# Altium project 8MPLUSLPD4-CPU.PrjPcb (part 3 of 3)

## Sheet Page12 SOM Interface.SchDoc
size 513 x 386 mm
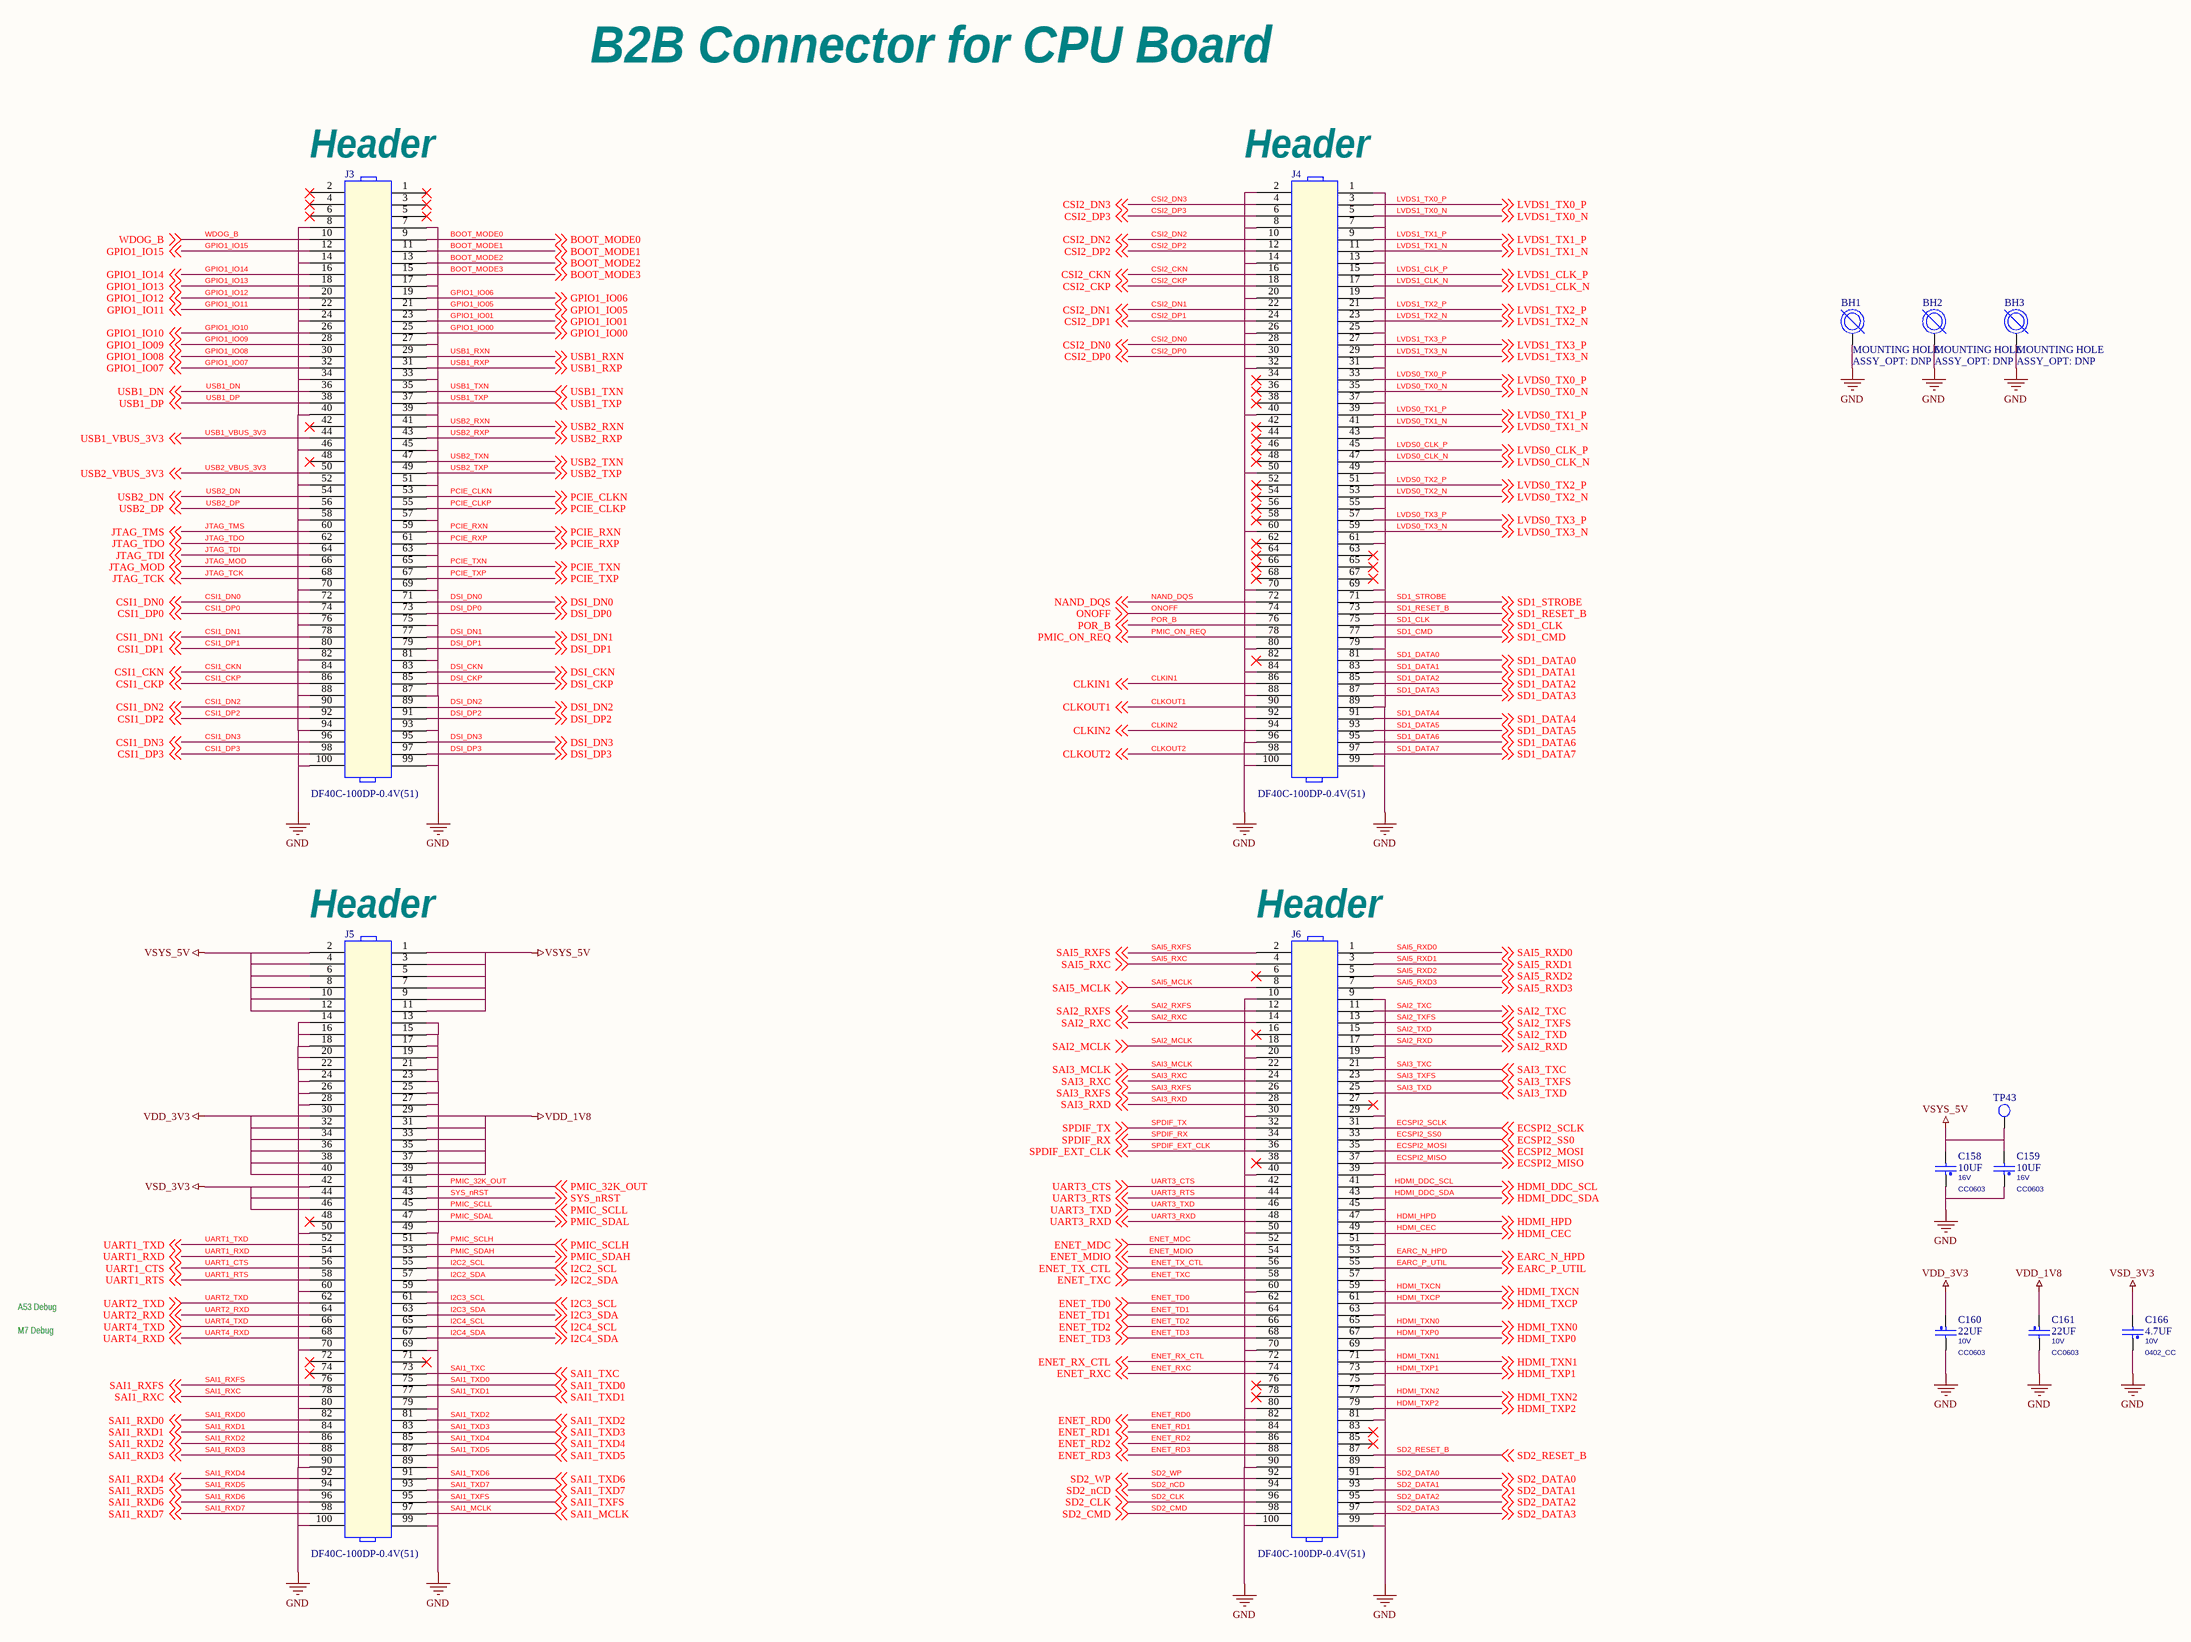
[diagram p17: Page12 SOM Interface.SchDoc]

### Parts
BH1  MOUNTING HOLE  ASSY_OPT: DNP  [GNDPOINT256]
BH2  MOUNTING HOLE  ASSY_OPT: DNP  [GNDPOINT256]
BH3  MOUNTING HOLE  ASSY_OPT: DNP  [GNDPOINT256]
C158  10UF  VOLTAGE: 16V  [CC0603]
C159  10UF  VOLTAGE: 16V  [CC0603]
C160  22UF  VOLTAGE: 10V  [CC0603]
C161  22UF  VOLTAGE: 10V  [CC0603]
C166  4.7UF  VOLTAGE: 10V  [0402_CC]
J3  DF40C-100DP-0.4V(51)  [con100_0p4_21p7x2p05_sm]
J4  DF40C-100DP-0.4V(51)  [con100_0p4_21p7x2p05_sm]
J5  DF40C-100DP-0.4V(51)  [con100_0p4_21p7x2p05_sm]
J6  DF40C-100DP-0.4V(51)  [con100_0p4_21p7x2p05_sm]
TP43  TP_35MIL  [testpoint_35mil]  (value not drawn)

### Nets
GND: BH1.1 BH2.1 BH3.1 C158.1 C159.1 C160.2 C161.2 C166.1 J3.7 J3.8 J3.14 J3.17 J3.24 J3.27 J3.33 J3.34 J3.39 J3.40 J3.45 J3.46 J3.51 J3.52 J3.57 J3.58 J3.63 J3.69 J3.70 J3.75 J3.76 J3.81 J3.82 J3.87 J3.88 J3.93 J3.94 J3.99 J3.100 J4.1 J4.2 J4.7 J4.8 J4.13 J4.14 J4.19 J4.20 J4.25 J4.26 J4.31 J4.32 J4.37 J4.40 J4.43 J4.49 J4.50 J4.55 J4.60 J4.61 J4.69 J4.70 J4.79 J4.80 J4.84 J4.88 J4.89 J4.92 J4.96 J4.99 J4.100 J5.13 J5.14 J5.15 J5.16 J5.17 J5.18 J5.19 J5.20 J5.21 J5.22 J5.23 J5.24 J5.25 J5.26 J5.27 J5.28 J5.49 J5.50 J5.59 J5.60 J5.69 J5.70 J5.79 J5.80 J5.89 J5.90 J5.99 J5.100 J6.9 J6.10 J6.19 J6.20 J6.29 J6.30 J6.39 J6.40 J6.45 J6.50 J6.51 J6.57 J6.60 J6.63 J6.69 J6.70 J6.75 J6.80 J6.81 J6.89 J6.90 J6.99 J6.100
VDD_1V8: C161.1 J5.29 J5.31 J5.33 J5.35 J5.37 J5.39
VDD_3V3: C160.1 J5.30 J5.32 J5.34 J5.36 J5.38 J5.40
VSD_3V3: C166.2 J5.42 J5.44 J5.46
VSYS_5V: C158.2 C159.2 J5.1 J5.2 J5.3 J5.4 J5.5 J5.6 J5.7 J5.8 J5.9 J5.10 J5.11 J5.12 TP43.1(TP)
BOOT_MODE0: J3.9 ; off-sheet BOOT_MODE0
BOOT_MODE1: J3.11 ; off-sheet BOOT_MODE1
BOOT_MODE2: J3.13 ; off-sheet BOOT_MODE2
BOOT_MODE3: J3.15 ; off-sheet BOOT_MODE3
CLKIN1: J4.86 ; off-sheet CLKIN1
CLKIN2: J4.94 ; off-sheet CLKIN2
CLKOUT1: J4.90 ; off-sheet CLKOUT1
CLKOUT2: J4.98 ; off-sheet CLKOUT2
CSI1_CKN: J3.84 ; off-sheet CSI1_CKN  [project net CSI1_CK_N]
CSI1_CKP: J3.86 ; off-sheet CSI1_CKP  [project net CSI1_CK_P]
CSI1_DN0: J3.72 ; off-sheet CSI1_DN0  [project net CSI1_D0_N]
CSI1_DN1: J3.78 ; off-sheet CSI1_DN1  [project net CSI1_D1_N]
CSI1_DN2: J3.90 ; off-sheet CSI1_DN2  [project net CSI1_D2_N]
CSI1_DN3: J3.96 ; off-sheet CSI1_DN3  [project net CSI1_D3_N]
CSI1_DP0: J3.74 ; off-sheet CSI1_DP0  [project net CSI1_D0_P]
CSI1_DP1: J3.80 ; off-sheet CSI1_DP1  [project net CSI1_D1_P]
CSI1_DP2: J3.92 ; off-sheet CSI1_DP2  [project net CSI1_D2_P]
CSI1_DP3: J3.98 ; off-sheet CSI1_DP3  [project net CSI1_D3_P]
CSI2_CKN: J4.16 ; off-sheet CSI2_CKN  [project net CSI2_CK_N]
CSI2_CKP: J4.18 ; off-sheet CSI2_CKP  [project net CSI2_CK_P]
CSI2_DN0: J4.28 ; off-sheet CSI2_DN0  [project net CSI2_D0_N]
CSI2_DN1: J4.22 ; off-sheet CSI2_DN1  [project net CSI2_D1_N]
CSI2_DN2: J4.10 ; off-sheet CSI2_DN2  [project net CSI2_D2_N]
CSI2_DN3: J4.4 ; off-sheet CSI2_DN3  [project net CSI2_D3_N]
CSI2_DP0: J4.30 ; off-sheet CSI2_DP0  [project net CSI2_D0_P]
CSI2_DP1: J4.24 ; off-sheet CSI2_DP1  [project net CSI2_D1_P]
CSI2_DP2: J4.12 ; off-sheet CSI2_DP2  [project net CSI2_D2_P]
CSI2_DP3: J4.6 ; off-sheet CSI2_DP3  [project net CSI2_D3_P]
DSI_CKN: J3.83 ; off-sheet DSI_CKN  [project net DSI_CK_N]
DSI_CKP: J3.85 ; off-sheet DSI_CKP  [project net DSI_CK_P]
DSI_DN0: J3.71 ; off-sheet DSI_DN0  [project net DSI_D0_N]
DSI_DN1: J3.77 ; off-sheet DSI_DN1  [project net DSI_D1_N]
DSI_DN2: J3.89 ; off-sheet DSI_DN2  [project net DSI_D2_N]
DSI_DN3: J3.95 ; off-sheet DSI_DN3  [project net DSI_D3_N]
DSI_DP0: J3.73 ; off-sheet DSI_DP0  [project net DSI_D0_P]
DSI_DP1: J3.79 ; off-sheet DSI_DP1  [project net DSI_D1_P]
DSI_DP2: J3.91 ; off-sheet DSI_DP2  [project net DSI_D2_P]
DSI_DP3: J3.97 ; off-sheet DSI_DP3  [project net DSI_D3_P]
EARC_N_HPD: J6.53 ; off-sheet EARC_N_HPD
EARC_P_UTIL: J6.55 ; off-sheet EARC_P_UTIL
ECSPI2_MISO: J6.37 ; off-sheet ECSPI2_MISO
ECSPI2_MOSI: J6.35 ; off-sheet ECSPI2_MOSI
ECSPI2_SCLK: J6.31 ; off-sheet ECSPI2_SCLK
ECSPI2_SS0: J6.33 ; off-sheet ECSPI2_SS0
ENET_MDC: J6.52 ; off-sheet ENET_MDC
ENET_MDIO: J6.54 ; off-sheet ENET_MDIO
ENET_RD0: J6.82 ; off-sheet ENET_RD0
ENET_RD1: J6.84 ; off-sheet ENET_RD1
ENET_RD2: J6.86 ; off-sheet ENET_RD2
ENET_RD3: J6.88 ; off-sheet ENET_RD3
ENET_RX_CTL: J6.72 ; off-sheet ENET_RX_CTL
ENET_RXC: J6.74 ; off-sheet ENET_RXC
ENET_TD0: J6.62 ; off-sheet ENET_TD0
ENET_TD1: J6.64 ; off-sheet ENET_TD1
ENET_TD2: J6.66 ; off-sheet ENET_TD2
ENET_TD3: J6.68 ; off-sheet ENET_TD3
ENET_TX_CTL: J6.56 ; off-sheet ENET_TX_CTL
ENET_TXC: J6.58 ; off-sheet ENET_TXC
GPIO1_IO00: J3.25 ; off-sheet GPIO1_IO00
GPIO1_IO01: J3.23 ; off-sheet GPIO1_IO01
GPIO1_IO05: J3.21 ; off-sheet GPIO1_IO05
GPIO1_IO06: J3.19 ; off-sheet GPIO1_IO06
GPIO1_IO07: J3.32 ; off-sheet GPIO1_IO07
GPIO1_IO08: J3.30 ; off-sheet GPIO1_IO08
GPIO1_IO09: J3.28 ; off-sheet GPIO1_IO09
GPIO1_IO10: J3.26 ; off-sheet GPIO1_IO10
GPIO1_IO11: J3.22 ; off-sheet GPIO1_IO11
GPIO1_IO12: J3.20 ; off-sheet GPIO1_IO12
GPIO1_IO13: J3.18 ; off-sheet GPIO1_IO13
GPIO1_IO14: J3.16 ; off-sheet GPIO1_IO14
GPIO1_IO15: J3.12 ; off-sheet GPIO1_IO15
HDMI_CEC: J6.49 ; off-sheet HDMI_CEC
HDMI_DDC_SCL: J6.41 ; off-sheet HDMI_DDC_SCL
HDMI_DDC_SDA: J6.43 ; off-sheet HDMI_DDC_SDA
HDMI_HPD: J6.47 ; off-sheet HDMI_HPD
HDMI_TXCN: J6.59 ; off-sheet HDMI_TXCN  [project net HDMI_TXC_N]
HDMI_TXCP: J6.61 ; off-sheet HDMI_TXCP  [project net HDMI_TXC_P]
HDMI_TXN0: J6.65 ; off-sheet HDMI_TXN0  [project net HDMI_TX0_N]
HDMI_TXN1: J6.71 ; off-sheet HDMI_TXN1  [project net HDMI_TX1_N]
HDMI_TXN2: J6.77 ; off-sheet HDMI_TXN2  [project net HDMI_TX2_N]
HDMI_TXP0: J6.67 ; off-sheet HDMI_TXP0  [project net HDMI_TX0_P]
HDMI_TXP1: J6.73 ; off-sheet HDMI_TXP1  [project net HDMI_TX1_P]
HDMI_TXP2: J6.79 ; off-sheet HDMI_TXP2  [project net HDMI_TX2_P]
I2C2_SCL: J5.55 ; off-sheet I2C2_SCL
I2C2_SDA: J5.57 ; off-sheet I2C2_SDA
I2C3_SCL: J5.61 ; off-sheet I2C3_SCL
I2C3_SDA: J5.63 ; off-sheet I2C3_SDA
I2C4_SCL: J5.65 ; off-sheet I2C4_SCL
I2C4_SDA: J5.67 ; off-sheet I2C4_SDA
JTAG_MOD: J3.66 ; off-sheet JTAG_MOD
JTAG_TCK: J3.68 ; off-sheet JTAG_TCK
JTAG_TDI: J3.64 ; off-sheet JTAG_TDI
JTAG_TDO: J3.62 ; off-sheet JTAG_TDO
JTAG_TMS: J3.60 ; off-sheet JTAG_TMS
LVDS0_CLK_N: J4.47 ; off-sheet LVDS0_CLK_N
LVDS0_CLK_P: J4.45 ; off-sheet LVDS0_CLK_P
LVDS0_TX0_N: J4.35 ; off-sheet LVDS0_TX0_N
LVDS0_TX0_P: J4.33 ; off-sheet LVDS0_TX0_P
LVDS0_TX1_N: J4.41 ; off-sheet LVDS0_TX1_N
LVDS0_TX1_P: J4.39 ; off-sheet LVDS0_TX1_P
LVDS0_TX2_N: J4.53 ; off-sheet LVDS0_TX2_N
LVDS0_TX2_P: J4.51 ; off-sheet LVDS0_TX2_P
LVDS0_TX3_N: J4.59 ; off-sheet LVDS0_TX3_N
LVDS0_TX3_P: J4.57 ; off-sheet LVDS0_TX3_P
LVDS1_CLK_N: J4.17 ; off-sheet LVDS1_CLK_N
LVDS1_CLK_P: J4.15 ; off-sheet LVDS1_CLK_P
LVDS1_TX0_N: J4.5 ; off-sheet LVDS1_TX0_N
LVDS1_TX0_P: J4.3 ; off-sheet LVDS1_TX0_P
LVDS1_TX1_N: J4.11 ; off-sheet LVDS1_TX1_N
LVDS1_TX1_P: J4.9 ; off-sheet LVDS1_TX1_P
LVDS1_TX2_N: J4.23 ; off-sheet LVDS1_TX2_N
LVDS1_TX2_P: J4.21 ; off-sheet LVDS1_TX2_P
LVDS1_TX3_N: J4.29 ; off-sheet LVDS1_TX3_N
LVDS1_TX3_P: J4.27 ; off-sheet LVDS1_TX3_P
NAND_DQS: J4.72 ; off-sheet NAND_DQS
ONOFF: J4.74 ; off-sheet ONOFF
PCIE_CLKN: J3.53 ; off-sheet PCIE_CLKN  [project net PCIE_CLK_N]
PCIE_CLKP: J3.55 ; off-sheet PCIE_CLKP  [project net PCIE_CLK_P]
PCIE_RXN: J3.59 ; off-sheet PCIE_RXN  [project net PCIE_RX_N]
PCIE_RXP: J3.61 ; off-sheet PCIE_RXP  [project net PCIE_RX_P]
PCIE_TXN: J3.65 ; off-sheet PCIE_TXN  [project net PCIE_TX_N]
PCIE_TXP: J3.67 ; off-sheet PCIE_TXP  [project net PCIE_TX_P]
PMIC_32K_OUT: J5.41 ; off-sheet PMIC_32K_OUT
PMIC_ON_REQ: J4.78 ; off-sheet PMIC_ON_REQ
PMIC_SCLH: J5.51 ; off-sheet PMIC_SCLH
PMIC_SCLL: J5.45 ; off-sheet PMIC_SCLL
PMIC_SDAH: J5.53 ; off-sheet PMIC_SDAH
PMIC_SDAL: J5.47 ; off-sheet PMIC_SDAL
POR_B: J4.76 ; off-sheet POR_B
SAI1_MCLK: J5.97 ; off-sheet SAI1_MCLK
SAI1_RXC: J5.78 ; off-sheet SAI1_RXC
SAI1_RXD0: J5.82 ; off-sheet SAI1_RXD0
SAI1_RXD1: J5.84 ; off-sheet SAI1_RXD1
SAI1_RXD2: J5.86 ; off-sheet SAI1_RXD2
SAI1_RXD3: J5.88 ; off-sheet SAI1_RXD3
SAI1_RXD4: J5.92 ; off-sheet SAI1_RXD4
SAI1_RXD5: J5.94 ; off-sheet SAI1_RXD5
SAI1_RXD6: J5.96 ; off-sheet SAI1_RXD6
SAI1_RXD7: J5.98 ; off-sheet SAI1_RXD7
SAI1_RXFS: J5.76 ; off-sheet SAI1_RXFS
SAI1_TXC: J5.73 ; off-sheet SAI1_TXC
SAI1_TXD0: J5.75 ; off-sheet SAI1_TXD0
SAI1_TXD1: J5.77 ; off-sheet SAI1_TXD1
SAI1_TXD2: J5.81 ; off-sheet SAI1_TXD2
SAI1_TXD3: J5.83 ; off-sheet SAI1_TXD3
SAI1_TXD4: J5.85 ; off-sheet SAI1_TXD4
SAI1_TXD5: J5.87 ; off-sheet SAI1_TXD5
SAI1_TXD6: J5.91 ; off-sheet SAI1_TXD6
SAI1_TXD7: J5.93 ; off-sheet SAI1_TXD7
SAI1_TXFS: J5.95 ; off-sheet SAI1_TXFS
SAI2_MCLK: J6.18 ; off-sheet SAI2_MCLK
SAI2_RXC: J6.14 ; off-sheet SAI2_RXC
SAI2_RXD: J6.17 ; off-sheet SAI2_RXD
SAI2_RXFS: J6.12 ; off-sheet SAI2_RXFS
SAI2_TXC: J6.11 ; off-sheet SAI2_TXC
SAI2_TXD: J6.15 ; off-sheet SAI2_TXD
SAI2_TXFS: J6.13 ; off-sheet SAI2_TXFS
SAI3_MCLK: J6.22 ; off-sheet SAI3_MCLK
SAI3_RXC: J6.24 ; off-sheet SAI3_RXC
SAI3_RXD: J6.28 ; off-sheet SAI3_RXD
SAI3_RXFS: J6.26 ; off-sheet SAI3_RXFS
SAI3_TXC: J6.21 ; off-sheet SAI3_TXC
SAI3_TXD: J6.25 ; off-sheet SAI3_TXD
SAI3_TXFS: J6.23 ; off-sheet SAI3_TXFS
SAI5_MCLK: J6.8 ; off-sheet SAI5_MCLK
SAI5_RXC: J6.4 ; off-sheet SAI5_RXC
SAI5_RXD0: J6.1 ; off-sheet SAI5_RXD0
SAI5_RXD1: J6.3 ; off-sheet SAI5_RXD1
SAI5_RXD2: J6.5 ; off-sheet SAI5_RXD2
SAI5_RXD3: J6.7 ; off-sheet SAI5_RXD3
SAI5_RXFS: J6.2 ; off-sheet SAI5_RXFS
SD1_CLK: J4.75 ; off-sheet SD1_CLK
SD1_CMD: J4.77 ; off-sheet SD1_CMD
SD1_DATA0: J4.81 ; off-sheet SD1_DATA0
SD1_DATA1: J4.83 ; off-sheet SD1_DATA1
SD1_DATA2: J4.85 ; off-sheet SD1_DATA2
SD1_DATA3: J4.87 ; off-sheet SD1_DATA3
SD1_DATA4: J4.91 ; off-sheet SD1_DATA4
SD1_DATA5: J4.93 ; off-sheet SD1_DATA5
SD1_DATA6: J4.95 ; off-sheet SD1_DATA6
SD1_DATA7: J4.97 ; off-sheet SD1_DATA7
SD1_RESET_B: J4.73 ; off-sheet SD1_RESET_B
SD1_STROBE: J4.71 ; off-sheet SD1_STROBE
SD2_CLK: J6.96 ; off-sheet SD2_CLK
SD2_CMD: J6.98 ; off-sheet SD2_CMD
SD2_DATA0: J6.91 ; off-sheet SD2_DATA0
SD2_DATA1: J6.93 ; off-sheet SD2_DATA1
SD2_DATA2: J6.95 ; off-sheet SD2_DATA2
SD2_DATA3: J6.97 ; off-sheet SD2_DATA3
SD2_nCD: J6.94 ; off-sheet SD2_nCD
SD2_RESET_B: J6.87 ; off-sheet SD2_RESET_B
SD2_WP: J6.92 ; off-sheet SD2_WP
SPDIF_EXT_CLK: J6.36 ; off-sheet SPDIF_EXT_CLK
SPDIF_RX: J6.34 ; off-sheet SPDIF_RX
SPDIF_TX: J6.32 ; off-sheet SPDIF_TX
SYS_nRST: J5.43 ; off-sheet SYS_nRST
UART1_CTS: J5.56 ; off-sheet UART1_CTS
UART1_RTS: J5.58 ; off-sheet UART1_RTS
UART1_RXD: J5.54 ; off-sheet UART1_RXD
UART1_TXD: J5.52 ; off-sheet UART1_TXD
UART2_RXD: J5.64 ; off-sheet UART2_RXD
UART2_TXD: J5.62 ; off-sheet UART2_TXD
UART3_CTS: J6.42 ; off-sheet UART3_CTS
UART3_RTS: J6.44 ; off-sheet UART3_RTS
UART3_RXD: J6.48 ; off-sheet UART3_RXD
UART3_TXD: J6.46 ; off-sheet UART3_TXD
UART4_RXD: J5.68 ; off-sheet UART4_RXD
UART4_TXD: J5.66 ; off-sheet UART4_TXD
USB1_DN: J3.36 ; off-sheet USB1_DN  [project net USB1_D_N]
USB1_DP: J3.38 ; off-sheet USB1_DP  [project net USB1_D_P]
USB1_RXN: J3.29 ; off-sheet USB1_RXN  [project net USB1_RX_N]
USB1_RXP: J3.31 ; off-sheet USB1_RXP  [project net USB1_RX_P]
USB1_TXN: J3.35 ; off-sheet USB1_TXN  [project net USB1_TX_N]
USB1_TXP: J3.37 ; off-sheet USB1_TXP  [project net USB1_TX_P]
USB1_VBUS_3V3: J3.44 ; off-sheet USB1_VBUS_3V3
USB2_DN: J3.54 ; off-sheet USB2_DN  [project net USB2_D_N]
USB2_DP: J3.56 ; off-sheet USB2_DP  [project net USB2_D_P]
USB2_RXN: J3.41 ; off-sheet USB2_RXN  [project net USB2_RX_N]
USB2_RXP: J3.43 ; off-sheet USB2_RXP  [project net USB2_RX_P]
USB2_TXN: J3.47 ; off-sheet USB2_TXN  [project net USB2_TX_N]
USB2_TXP: J3.49 ; off-sheet USB2_TXP  [project net USB2_TX_P]
USB2_VBUS_3V3: J3.50 ; off-sheet USB2_VBUS_3V3
WDOG_B: J3.10 ; off-sheet WDOG_B

Not connected (* = marked no-connect by the designer): J3 1* 2* 3* 4* 5* 6* 42* 48*; J4 34* 36* 38* 42* 44* 46* 48* 52* 54* 56* 58* 62* 63* 64* 65* 66* 67* 68* 82*; J5 48* 71* 72* 74*; J6 6* 16* 27* 38* 76* 78* 83* 85*

### Notes on the sheet
- B2B Connector for CPU Board
- (near J3) Header
- (near J4) Header
- (near J5) Header
- (near J6) Header
- A53 Debug
- M7 Debug

### Library data of the parts
BH1 = MOUNT_HOLE: MOUNTING HOLE DRILL 109 PAD 200 PLATED TH NO PART TO ORDER; CLASS: IC; CAD_APPROVED: Yes; AGILE_PN: 280-75147; HEIGHT: 0.005 MILS; ROHS: Yes; PCB Footprint: GNDPOINT256
BH2 BH3 = MOUNT_HOLE: MOUNTING HOLE DRILL 109 PAD 200 PLATED TH NO PART TO ORDER; CLASS: IC; AGILE_PN: 280-75147; CAD_APPROVED: Yes; ROHS: Yes; HEIGHT: 0.005 MILS; PCB Footprint: GNDPOINT256
C158 = CAP_NP: CAP CER 10.0uF 16V 10% X5R 0603; CLASS: DISCRETE; Temp Range: -55¡ãC to +85¡ãC; AGILE_PN: 150-80060; MFG_NAME01: MURATA; MFG_PN01: GRM188R61C106KAALD; CAD_APPROVED: Yes; FPLIST: CC0603_OV,CC0603,0603_CC,cc0603_0805_nsp; PCB Footprint: CC0603; Package Type: SMT; Package Size: 0603; Tolerance: 10%; ROHS: Yes; Temp_Range: -55¡ãC to +85¡ãC; HEIGHT: 0.9MM
C159 = CAP_NP: CAP CER 10.0uF 16V 10% X5R 0603; CLASS: DISCRETE; Temp Range: -55¡ãC to +85¡ãC; FPLIST: CC0603_OV,CC0603,0603_CC,cc0603_0805_nsp; CAD_APPROVED: Yes; MFG_PN01: GRM188R61C106KAALD; MFG_NAME01: MURATA; AGILE_PN: 150-80060; PCB Footprint: CC0603; Package Type: SMT; Package Size: 0603; HEIGHT: 0.9MM; Temp_Range: -55¡ãC to +85¡ãC; ROHS: Yes; Tolerance: 10%
C160 C161 = CAP_NP: CAP CER 22uF 10V 20% X5R 0603; CLASS: DISCRETE; WVDC: 6.3V; AGILE_PN: 150-79530; MFG_NAME01: TDK; MFG_PN01: C1608X5R1A226M080AC; CAD_APPROVED: Yes; FPLIST: CC0603_OV,CC0603,0603_CC; SIGNAL_MODEL: DEFAULT_CAPACITOR_2.2e+07pF_2_1; PCB Footprint: CC0603; Package Size: 0603; Tolerance: 20%; ROHS: Yes; HEIGHT: 1MM
C166 = CAP_NP: CAP CER 4.7uF 10V 10% X5R 0402; CLASS: DISCRETE; AGILE_PN: 150-80044; MFG_NAME01: Samsung Electro Mechanics; MFG_PN01: CL05A475KP5NRNC; CAD_APPROVED: Yes; FPLIST: CC0402_25,CC0402_HD,0402_CC; PCB Footprint: 0402_CC; Tolerance: 10%; ROHS: Yes; HEIGHT: 0.65MM
J3 J4 J6 = HDR_2X50_M: CON 2X50 PLUG SHRD SMT 0.4MM SP 51H AU; CLASS: IO; Temp Range: -35 to 85 &#8451;; CAD_APPROVED: Yes; MFG_NAME01: HIROSE; AGILE_PN: 211-80305; HEIGHT: 1.29MM; Temp_Range: -35 to 85 &#8451;; ROHS: Yes; MFG_PN01: DF40C-100DP-0.4V(51); PCB Footprint: con100_0p4_21p7x2p05_sm
J5 = HDR_2X50_M: CON 2X50 PLUG SHRD SMT 0.4MM SP 51H AU; CLASS: IO; Temp Range: -35 to 85 &#8451;; AGILE_PN: 211-80305; MFG_NAME01: HIROSE; CAD_APPROVED: Yes; MFG_PN01: DF40C-100DP-0.4V(51); ROHS: Yes; Temp_Range: -35 to 85 &#8451;; HEIGHT: 1.29MM; PCB Footprint: con100_0p4_21p7x2p05_sm
TP43 = T POINT R: TEST POINT PAD .035 SMT, no part to order; CLASS: IC; ASSY_OPT: DNP; AGILE_PN: 510-75618; CAD_APPROVED: Yes; PCB Footprint: testpoint_35mil; ROHS: Yes; HEIGHT: 0.1MM

## Nets that join several sheets
GND: Page04 CPU PWR (173 pins), Page05 LPDDR4 (86 pins), Page06 CPU IO (C105.2 Q1.2), Page07 CPU PHY (6 pins), Page08 CPU MISC (8 pins), Page09 eMMC_QSPI (24 pins), Page11 PMIC (40 pins), Page12 SOM Interface (119 pins)
NVCC_SD2: Page04 CPU PWR (C19.1 U1.W24), Page06 CPU IO (R21.1 R22.1 R23.1), Page11 PMIC (C148.1 TP34.1 U6.55)
NVCC_SNVS_1V8: Page04 CPU PWR (C10.1 U1.R24), Page08 CPU MISC (R28.1 R29.1 R30.1), Page11 PMIC (C132.1 R55.1 TP28.1 U6.3)
ODT_CA_A: Page04 CPU PWR (18 pins), Page05 LPDDR4 (64 pins), Page11 PMIC (5 pins)
VDD_1V8: Page04 CPU PWR (22 pins), Page05 LPDDR4 (14 pins), Page06 CPU IO (6 pins), Page09 eMMC_QSPI (15 pins), Page11 PMIC (6 pins), Page12 SOM Interface (7 pins)
VDD_3V3: Page04 CPU PWR (C20.1 U1.J14), Page06 CPU IO (R12.1), Page09 eMMC_QSPI (7 pins), Page11 PMIC (7 pins), Page12 SOM Interface (7 pins)
VDD_ARM: Page04 CPU PWR (26 pins), Page11 PMIC (6 pins)
VDD_SOC: Page04 CPU PWR (64 pins), Page11 PMIC (9 pins)
VDDA_1V8: Page04 CPU PWR (24 pins), Page11 PMIC (C139.1 tp30.1 U6.54)
VSD_3V3: Page11 PMIC (C153.2 U6.23), Page12 SOM Interface (C166.2 J5.42 J5.44 J5.46)
VSYS_5V: Page11 PMIC (21 pins), Page12 SOM Interface (15 pins)
BOOT_MODE0: Page08 CPU MISC (U1.G10), Page10 BOOT_CFG (TP51.1), Page12 SOM Interface (J3.9)
BOOT_MODE1: Page08 CPU MISC (U1.F8), Page10 BOOT_CFG (TP52.1), Page12 SOM Interface (J3.11)
BOOT_MODE2: Page08 CPU MISC (U1.G8), Page12 SOM Interface (J3.13)
BOOT_MODE3: Page08 CPU MISC (U1.G12), Page12 SOM Interface (J3.15)
CLKIN1: Page08 CPU MISC (TP13.1 U1.K28), Page12 SOM Interface (J4.86)
CLKIN2: Page08 CPU MISC (TP14.1 U1.L28), Page12 SOM Interface (J4.94)
CLKOUT1: Page08 CPU MISC (TP46.1 U1.K29), Page12 SOM Interface (J4.90)
CLKOUT2: Page08 CPU MISC (TP45.1 U1.L29), Page12 SOM Interface (J4.98)
CSI1_CK_N: Page07 CPU PHY (U1.E22), Page12 SOM Interface (J3.84)
CSI1_CK_P: Page07 CPU PHY (U1.D22), Page12 SOM Interface (J3.86)
CSI1_D0_N: Page07 CPU PHY (U1.E18), Page12 SOM Interface (J3.72)
CSI1_D0_P: Page07 CPU PHY (U1.D18), Page12 SOM Interface (J3.74)
CSI1_D1_N: Page07 CPU PHY (U1.E20), Page12 SOM Interface (J3.78)
CSI1_D1_P: Page07 CPU PHY (U1.D20), Page12 SOM Interface (J3.80)
CSI1_D2_N: Page07 CPU PHY (U1.E24), Page12 SOM Interface (J3.90)
CSI1_D2_P: Page07 CPU PHY (U1.D24), Page12 SOM Interface (J3.92)
CSI1_D3_N: Page07 CPU PHY (U1.E26), Page12 SOM Interface (J3.96)
CSI1_D3_P: Page07 CPU PHY (U1.D26), Page12 SOM Interface (J3.98)
CSI2_CK_N: Page07 CPU PHY (U1.B23), Page12 SOM Interface (J4.16)
CSI2_CK_P: Page07 CPU PHY (U1.A23), Page12 SOM Interface (J4.18)
CSI2_D0_N: Page07 CPU PHY (U1.B25), Page12 SOM Interface (J4.28)
CSI2_D0_P: Page07 CPU PHY (U1.A25), Page12 SOM Interface (J4.30)
CSI2_D1_N: Page07 CPU PHY (U1.B24), Page12 SOM Interface (J4.22)
CSI2_D1_P: Page07 CPU PHY (U1.A24), Page12 SOM Interface (J4.24)
CSI2_D2_N: Page07 CPU PHY (U1.B22), Page12 SOM Interface (J4.10)
CSI2_D2_P: Page07 CPU PHY (U1.A22), Page12 SOM Interface (J4.12)
CSI2_D3_N: Page07 CPU PHY (U1.B21), Page12 SOM Interface (J4.4)
CSI2_D3_P: Page07 CPU PHY (U1.A21), Page12 SOM Interface (J4.6)
DSI_CK_N: Page07 CPU PHY (U1.B18), Page12 SOM Interface (J3.83)
DSI_CK_P: Page07 CPU PHY (U1.A18), Page12 SOM Interface (J3.85)
DSI_D0_N: Page07 CPU PHY (U1.B16), Page12 SOM Interface (J3.71)
DSI_D0_P: Page07 CPU PHY (U1.A16), Page12 SOM Interface (J3.73)
DSI_D1_N: Page07 CPU PHY (U1.B17), Page12 SOM Interface (J3.77)
DSI_D1_P: Page07 CPU PHY (U1.A17), Page12 SOM Interface (J3.79)
DSI_D2_N: Page07 CPU PHY (U1.B19), Page12 SOM Interface (J3.89)
DSI_D2_P: Page07 CPU PHY (U1.A19), Page12 SOM Interface (J3.91)
DSI_D3_N: Page07 CPU PHY (U1.B20), Page12 SOM Interface (J3.95)
DSI_D3_P: Page07 CPU PHY (U1.A20), Page12 SOM Interface (J3.97)
EARC_N_HPD: Page07 CPU PHY (U1.AH22), Page12 SOM Interface (J6.53)
EARC_P_UTIL: Page07 CPU PHY (U1.AJ23), Page12 SOM Interface (J6.55)
ECSPI2_MISO: Page06 CPU IO (U1.AH20), Page12 SOM Interface (J6.37)
ECSPI2_MOSI: Page06 CPU IO (U1.AJ21), Page12 SOM Interface (J6.35)
ECSPI2_SCLK: Page06 CPU IO (U1.AH21), Page12 SOM Interface (J6.31)
ECSPI2_SS0: Page06 CPU IO (U1.AJ22), Page12 SOM Interface (J6.33)
ENET_MDC: Page06 CPU IO (U1.AH28), Page12 SOM Interface (J6.52)
ENET_MDIO: Page06 CPU IO (U1.AH29), Page12 SOM Interface (J6.54)
ENET_RD0: Page06 CPU IO (U1.AG29), Page12 SOM Interface (J6.82)
ENET_RD1: Page06 CPU IO (U1.AG28), Page12 SOM Interface (J6.84)
ENET_RD2: Page06 CPU IO (U1.AF29), Page12 SOM Interface (J6.86)
ENET_RD3: Page06 CPU IO (U1.AF28), Page12 SOM Interface (J6.88)
ENET_RX_CTL: Page06 CPU IO (U1.AE28), Page12 SOM Interface (J6.72)
ENET_RXC: Page06 CPU IO (U1.AE29), Page12 SOM Interface (J6.74)
ENET_TD0: Page06 CPU IO (U1.AC25), Page12 SOM Interface (J6.62)
ENET_TD1: Page06 CPU IO (U1.AE26), Page12 SOM Interface (J6.64)
ENET_TD2: Page06 CPU IO (U1.AF26), Page12 SOM Interface (J6.66)
ENET_TD3: Page06 CPU IO (U1.AD24), Page12 SOM Interface (J6.68)
ENET_TX_CTL: Page06 CPU IO (U1.AF24), Page12 SOM Interface (J6.56)
ENET_TXC: Page06 CPU IO (U1.AE24), Page12 SOM Interface (J6.58)
GPIO1_IO00: Page06 CPU IO (TP26.1 U1.A7), Page12 SOM Interface (J3.25)
GPIO1_IO01: Page06 CPU IO (U1.E8), Page12 SOM Interface (J3.23)
GPIO1_IO05: Page06 CPU IO (U1.B4), Page12 SOM Interface (J3.21)
GPIO1_IO06: Page06 CPU IO (U1.A3), Page12 SOM Interface (J3.19)
GPIO1_IO07: Page06 CPU IO (U1.F6), Page12 SOM Interface (J3.32)
GPIO1_IO08: Page06 CPU IO (U1.A8), Page12 SOM Interface (J3.30)
GPIO1_IO09: Page06 CPU IO (U1.B8), Page12 SOM Interface (J3.28)
GPIO1_IO10: Page06 CPU IO (U1.B7), Page12 SOM Interface (J3.26)
GPIO1_IO11: Page06 CPU IO (U1.D8), Page12 SOM Interface (J3.22)
GPIO1_IO12: Page06 CPU IO (U1.A5), Page12 SOM Interface (J3.20)
GPIO1_IO13: Page06 CPU IO (U1.A6), Page12 SOM Interface (J3.18)
GPIO1_IO14: Page06 CPU IO (U1.A4), Page12 SOM Interface (J3.16)
GPIO1_IO15: Page06 CPU IO (U1.B5), Page12 SOM Interface (J3.12)
HDMI_CEC: Page07 CPU PHY (U1.AD22), Page12 SOM Interface (J6.49)
HDMI_DDC_SCL: Page07 CPU PHY (U1.AC22), Page12 SOM Interface (J6.41)
HDMI_DDC_SDA: Page07 CPU PHY (U1.AF22), Page12 SOM Interface (J6.43)
HDMI_HPD: Page07 CPU PHY (U1.AE22), Page12 SOM Interface (J6.47)
HDMI_TX0_N: Page07 CPU PHY (U1.AJ25), Page12 SOM Interface (J6.65)
HDMI_TX0_P: Page07 CPU PHY (U1.AH25), Page12 SOM Interface (J6.67)
HDMI_TX1_N: Page07 CPU PHY (U1.AJ26), Page12 SOM Interface (J6.71)
HDMI_TX1_P: Page07 CPU PHY (U1.AH26), Page12 SOM Interface (J6.73)
HDMI_TX2_N: Page07 CPU PHY (U1.AJ27), Page12 SOM Interface (J6.77)
HDMI_TX2_P: Page07 CPU PHY (U1.AH27), Page12 SOM Interface (J6.79)
HDMI_TXC_N: Page07 CPU PHY (U1.AJ24), Page12 SOM Interface (J6.59)
HDMI_TXC_P: Page07 CPU PHY (U1.AH24), Page12 SOM Interface (J6.61)
I2C1_SCL: Page06 CPU IO (R13.2 U1.AC8), Page11 PMIC (R62.1)
I2C1_SDA: Page06 CPU IO (R14.2 U1.AH7), Page11 PMIC (R64.1)
I2C2_SCL: Page06 CPU IO (R15.2 U1.AH6), Page12 SOM Interface (J5.55)
I2C2_SDA: Page06 CPU IO (R16.2 U1.AE8), Page12 SOM Interface (J5.57)
I2C3_SCL: Page06 CPU IO (R17.2 U1.AJ7), Page12 SOM Interface (J5.61)
I2C3_SDA: Page06 CPU IO (R18.2 U1.AJ6), Page12 SOM Interface (J5.63)
I2C4_SCL: Page06 CPU IO (U1.AF8), Page12 SOM Interface (J5.65)
I2C4_SDA: Page06 CPU IO (U1.AD8), Page12 SOM Interface (J5.67)
JTAG_MOD: Page08 CPU MISC (R32.1 TP22.1 U1.G20), Page12 SOM Interface (J3.66)
JTAG_TCK: Page08 CPU MISC (R31.1 TP5.1 U1.G18), Page12 SOM Interface (J3.68)
JTAG_TDI: Page08 CPU MISC (TP3.1 U1.G16), Page12 SOM Interface (J3.64)
JTAG_TDO: Page08 CPU MISC (TP6.1 U1.F14), Page12 SOM Interface (J3.62)
JTAG_TMS: Page08 CPU MISC (TP4.1 U1.G14), Page12 SOM Interface (J3.60)
LVDS0_CLK_N: Page07 CPU PHY (U1.G28), Page12 SOM Interface (J4.47)
LVDS0_CLK_P: Page07 CPU PHY (U1.F29), Page12 SOM Interface (J4.45)
LVDS0_TX0_N: Page07 CPU PHY (U1.E28), Page12 SOM Interface (J4.35)
LVDS0_TX0_P: Page07 CPU PHY (U1.D29), Page12 SOM Interface (J4.33)
LVDS0_TX1_N: Page07 CPU PHY (U1.F28), Page12 SOM Interface (J4.41)
LVDS0_TX1_P: Page07 CPU PHY (U1.E29), Page12 SOM Interface (J4.39)
LVDS0_TX2_N: Page07 CPU PHY (U1.H28), Page12 SOM Interface (J4.53)
LVDS0_TX2_P: Page07 CPU PHY (U1.G29), Page12 SOM Interface (J4.51)
LVDS0_TX3_N: Page07 CPU PHY (U1.J28), Page12 SOM Interface (J4.59)
LVDS0_TX3_P: Page07 CPU PHY (U1.H29), Page12 SOM Interface (J4.57)
LVDS1_CLK_N: Page07 CPU PHY (U1.B28), Page12 SOM Interface (J4.17)
LVDS1_CLK_P: Page07 CPU PHY (U1.A28), Page12 SOM Interface (J4.15)
LVDS1_TX0_N: Page07 CPU PHY (U1.B26), Page12 SOM Interface (J4.5)
LVDS1_TX0_P: Page07 CPU PHY (U1.A26), Page12 SOM Interface (J4.3)
LVDS1_TX1_N: Page07 CPU PHY (U1.B27), Page12 SOM Interface (J4.11)
LVDS1_TX1_P: Page07 CPU PHY (U1.A27), Page12 SOM Interface (J4.9)
LVDS1_TX2_N: Page07 CPU PHY (U1.C28), Page12 SOM Interface (J4.23)
LVDS1_TX2_P: Page07 CPU PHY (U1.B29), Page12 SOM Interface (J4.21)
LVDS1_TX3_N: Page07 CPU PHY (U1.D28), Page12 SOM Interface (J4.29)
LVDS1_TX3_P: Page07 CPU PHY (U1.C29), Page12 SOM Interface (J4.27)
NAND_DQS: Page06 CPU IO (R11.2), Page12 SOM Interface (J4.72)
ONOFF: Page08 CPU MISC (R30.2 TP7.1 U1.G22), Page12 SOM Interface (J4.74)
PCIE_CLK_N: Page07 CPU PHY (U1.E16), Page12 SOM Interface (J3.53)
PCIE_CLK_P: Page07 CPU PHY (U1.D16), Page12 SOM Interface (J3.55)
PCIE_RX_N: Page07 CPU PHY (U1.B14), Page12 SOM Interface (J3.59)
PCIE_RX_P: Page07 CPU PHY (U1.A14), Page12 SOM Interface (J3.61)
PCIE_TX_N: Page07 CPU PHY (U1.B15), Page12 SOM Interface (J3.65)
PCIE_TX_P: Page07 CPU PHY (U1.A15), Page12 SOM Interface (J3.67)
PMIC_32K_OUT: Page11 PMIC (R75.2), Page12 SOM Interface (J5.41)
PMIC_nINT: Page06 CPU IO (U1.D6), Page11 PMIC (U6.13)
PMIC_ON_REQ: Page08 CPU MISC (R28.2 TP9.1 U1.F22), Page11 PMIC (R57.1), Page12 SOM Interface (J4.78)
PMIC_SCLH: Page11 PMIC (U6.25), Page12 SOM Interface (J5.51)
PMIC_SCLL: Page11 PMIC (U6.27), Page12 SOM Interface (J5.45)
PMIC_SDAH: Page11 PMIC (U6.24), Page12 SOM Interface (J5.53)
PMIC_SDAL: Page11 PMIC (U6.26), Page12 SOM Interface (J5.47)
PMIC_STBY_REQ: Page08 CPU MISC (TP10.1 U1.J24), Page11 PMIC (R58.1)
POR_B: Page08 CPU MISC (R29.2 TP8.1 U1.J29), Page11 PMIC (R63.2), Page12 SOM Interface (J4.76)
QSPIA_DATA0: Page06 CPU IO (U1.R25), Page09 eMMC_QSPI (tp20.1 U4.5)
QSPIA_DATA1: Page06 CPU IO (U1.L25), Page09 eMMC_QSPI (U4.2)
QSPIA_DATA2: Page06 CPU IO (U1.L24), Page09 eMMC_QSPI (U4.3)
QSPIA_DATA3: Page06 CPU IO (U1.N24), Page09 eMMC_QSPI (U4.7)
QSPIA_nSS0: Page06 CPU IO (U1.L26), Page09 eMMC_QSPI (R38.2 U4.1)
QSPIA_SCLK: Page06 CPU IO (U1.N25), Page09 eMMC_QSPI (TP21.1 U4.6)
SAI1_MCLK: Page06 CPU IO (U1.AE12), Page12 SOM Interface (J5.97)
SAI1_RXC: Page06 CPU IO (U1.AH8), Page12 SOM Interface (J5.78)
SAI1_RXD0: Page06 CPU IO (U1.AC10), Page12 SOM Interface (J5.82)
SAI1_RXD1: Page06 CPU IO (U1.AF10), Page12 SOM Interface (J5.84)
SAI1_RXD2: Page06 CPU IO (U1.AH9), Page12 SOM Interface (J5.86)
SAI1_RXD3: Page06 CPU IO (U1.AJ8), Page12 SOM Interface (J5.88)
SAI1_RXD4: Page06 CPU IO (U1.AD10), Page12 SOM Interface (J5.92)
SAI1_RXD5: Page06 CPU IO (U1.AE10), Page12 SOM Interface (J5.94)
SAI1_RXD6: Page06 CPU IO (U1.AH10), Page12 SOM Interface (J5.96)
SAI1_RXD7: Page06 CPU IO (U1.AH12), Page12 SOM Interface (J5.98)
SAI1_RXFS: Page06 CPU IO (U1.AJ9), Page12 SOM Interface (J5.76)
SAI1_TXC: Page06 CPU IO (U1.AJ12), Page12 SOM Interface (J5.73)
SAI1_TXD0: Page06 CPU IO (U1.AJ11), Page12 SOM Interface (J5.75)
SAI1_TXD1: Page06 CPU IO (U1.AJ10), Page12 SOM Interface (J5.77)
SAI1_TXD2: Page06 CPU IO (U1.AH11), Page12 SOM Interface (J5.81)
SAI1_TXD3: Page06 CPU IO (U1.AD12), Page12 SOM Interface (J5.83)
SAI1_TXD4: Page06 CPU IO (U1.AH13), Page12 SOM Interface (J5.85)
SAI1_TXD5: Page06 CPU IO (U1.AH14), Page12 SOM Interface (J5.87)
SAI1_TXD6: Page06 CPU IO (U1.AC12), Page12 SOM Interface (J5.91)
SAI1_TXD7: Page06 CPU IO (U1.AJ13), Page12 SOM Interface (J5.93)
SAI1_TXFS: Page06 CPU IO (U1.AF12), Page12 SOM Interface (J5.95)
SAI2_MCLK: Page06 CPU IO (U1.AJ15), Page12 SOM Interface (J6.18)
SAI2_RXC: Page06 CPU IO (U1.AJ16), Page12 SOM Interface (J6.14)
SAI2_RXD: Page06 CPU IO (U1.AJ14), Page12 SOM Interface (J6.17)
SAI2_RXFS: Page06 CPU IO (U1.AH17), Page12 SOM Interface (J6.12)
SAI2_TXC: Page06 CPU IO (U1.AH15), Page12 SOM Interface (J6.11)
SAI2_TXD: Page06 CPU IO (U1.AH16), Page12 SOM Interface (J6.15)
SAI2_TXFS: Page06 CPU IO (U1.AJ17), Page12 SOM Interface (J6.13)
SAI3_MCLK: Page06 CPU IO (U1.AJ20), Page12 SOM Interface (J6.22)
SAI3_RXC: Page06 CPU IO (U1.AJ18), Page12 SOM Interface (J6.24)
SAI3_RXD: Page06 CPU IO (U1.AF18), Page12 SOM Interface (J6.28)
SAI3_RXFS: Page06 CPU IO (U1.AJ19), Page12 SOM Interface (J6.26)
SAI3_TXC: Page06 CPU IO (U1.AH19), Page12 SOM Interface (J6.21)
SAI3_TXD: Page06 CPU IO (U1.AH18), Page12 SOM Interface (J6.25)
SAI3_TXFS: Page06 CPU IO (U1.AC16), Page12 SOM Interface (J6.23)
SAI5_MCLK: Page06 CPU IO (U1.AF14), Page12 SOM Interface (J6.8)
SAI5_RXC: Page06 CPU IO (U1.AD14), Page12 SOM Interface (J6.4)
SAI5_RXD0: Page06 CPU IO (U1.AE16), Page12 SOM Interface (J6.1)
SAI5_RXD1: Page06 CPU IO (U1.AD16), Page12 SOM Interface (J6.3)
SAI5_RXD2: Page06 CPU IO (U1.AF16), Page12 SOM Interface (J6.5)
SAI5_RXD3: Page06 CPU IO (U1.AE14), Page12 SOM Interface (J6.7)
SAI5_RXFS: Page06 CPU IO (U1.AC14), Page12 SOM Interface (J6.2)
SD1_CLK: Page06 CPU IO (U1.W28), Page12 SOM Interface (J4.75)
SD1_CMD: Page06 CPU IO (U1.W29), Page12 SOM Interface (J4.77)
SD1_DATA0: Page06 CPU IO (U1.Y29), Page12 SOM Interface (J4.81)
SD1_DATA1: Page06 CPU IO (U1.Y28), Page12 SOM Interface (J4.83)
SD1_DATA2: Page06 CPU IO (U1.V29), Page12 SOM Interface (J4.85)
SD1_DATA3: Page06 CPU IO (U1.V28), Page12 SOM Interface (J4.87)
SD1_DATA4: Page06 CPU IO (U1.U26), Page12 SOM Interface (J4.91)
SD1_DATA5: Page06 CPU IO (U1.AA29), Page12 SOM Interface (J4.93)
SD1_DATA6: Page06 CPU IO (U1.AA28), Page12 SOM Interface (J4.95)
SD1_DATA7: Page06 CPU IO (U1.U25), Page12 SOM Interface (J4.97)
SD1_RESET_B: Page06 CPU IO (U1.W25), Page12 SOM Interface (J4.73)
SD1_STROBE: Page06 CPU IO (U1.W26), Page12 SOM Interface (J4.71)
SD2_CLK: Page06 CPU IO (U1.AB29), Page12 SOM Interface (J6.96)
SD2_CMD: Page06 CPU IO (R22.2 U1.AB28), Page12 SOM Interface (J6.98)
SD2_DATA0: Page06 CPU IO (R21.2 U1.AC28), Page12 SOM Interface (J6.91)
SD2_DATA1: Page06 CPU IO (U1.AC29), Page12 SOM Interface (J6.93)
SD2_DATA2: Page06 CPU IO (U1.AA26), Page12 SOM Interface (J6.95)
SD2_DATA3: Page06 CPU IO (U1.AA25), Page12 SOM Interface (J6.97)
SD2_nCD: Page06 CPU IO (U1.AD29), Page12 SOM Interface (J6.94)
SD2_RESET_B: Page06 CPU IO (R23.2 U1.AD28), Page11 PMIC (R54.1), Page12 SOM Interface (J6.87)
SD2_VSEL: Page06 CPU IO (U1.E6), Page11 PMIC (U6.29)
SD2_WP: Page06 CPU IO (U1.AC26), Page12 SOM Interface (J6.92)
SD3_CLK: Page06 CPU IO (U1.U28), Page09 eMMC_QSPI (TP18.1 U3.M6)
SD3_CMD: Page06 CPU IO (U1.U29), Page09 eMMC_QSPI (R37.2 TP17.1 U3.M5)
SD3_DATA0: Page06 CPU IO (U1.P29), Page09 eMMC_QSPI (R36.2 TP15.1 U3.A3)
SD3_DATA1: Page06 CPU IO (U1.N29), Page09 eMMC_QSPI (U3.A4)
SD3_DATA2: Page06 CPU IO (U1.M29), Page09 eMMC_QSPI (U3.A5)
SD3_DATA3: Page06 CPU IO (U1.R29), Page09 eMMC_QSPI (U3.B2)
SD3_DATA4: Page06 CPU IO (U1.R28), Page09 eMMC_QSPI (U3.B3)
SD3_DATA5: Page06 CPU IO (U1.P28), Page09 eMMC_QSPI (U3.B4)
SD3_DATA6: Page06 CPU IO (U1.N28), Page09 eMMC_QSPI (U3.B5)
SD3_DATA7: Page06 CPU IO (U1.M28), Page09 eMMC_QSPI (U3.B6)
SD3_STROBE: Page06 CPU IO (U1.T29), Page09 eMMC_QSPI (TP16.1 U3.H5)
SPDIF_EXT_CLK: Page06 CPU IO (U1.AC18), Page12 SOM Interface (J6.36)
SPDIF_RX: Page06 CPU IO (U1.AD18), Page12 SOM Interface (J6.34)
SPDIF_TX: Page06 CPU IO (U1.AE18), Page12 SOM Interface (J6.32)
SYS_nRST: Page11 PMIC (R56.1 TP40.1), Page12 SOM Interface (J5.43)
UART1_CTS: Page06 CPU IO (U1.AE6), Page12 SOM Interface (J5.56)
UART1_RTS: Page06 CPU IO (U1.AJ4), Page12 SOM Interface (J5.58)
UART1_RXD: Page06 CPU IO (U1.AD6), Page12 SOM Interface (J5.54)
UART1_TXD: Page06 CPU IO (U1.AJ3), Page12 SOM Interface (J5.52)
UART2_RXD: Page06 CPU IO (U1.AF6), Page10 BOOT_CFG (TP54.1), Page12 SOM Interface (J5.64)
UART2_TXD: Page06 CPU IO (U1.AH4), Page10 BOOT_CFG (TP53.1), Page12 SOM Interface (J5.62)
UART3_CTS: Page06 CPU IO (U1.AD20), Page12 SOM Interface (J6.42)
UART3_RTS: Page06 CPU IO (U1.AE20), Page12 SOM Interface (J6.44)
UART3_RXD: Page06 CPU IO (U1.AF20), Page12 SOM Interface (J6.48)
UART3_TXD: Page06 CPU IO (U1.AC20), Page12 SOM Interface (J6.46)
UART4_RXD: Page06 CPU IO (U1.AJ5), Page10 BOOT_CFG (TP56.1), Page12 SOM Interface (J5.68)
UART4_TXD: Page06 CPU IO (U1.AH5), Page10 BOOT_CFG (TP55.1), Page12 SOM Interface (J5.66)
USB1_D_N: Page07 CPU PHY (U1.E10), Page10 BOOT_CFG (TP58.1), Page12 SOM Interface (J3.36)
USB1_D_P: Page07 CPU PHY (U1.D10), Page10 BOOT_CFG (TP59.1), Page12 SOM Interface (J3.38)
USB1_RX_N: Page07 CPU PHY (U1.B9), Page12 SOM Interface (J3.29)
USB1_RX_P: Page07 CPU PHY (U1.A9), Page12 SOM Interface (J3.31)
USB1_TX_N: Page07 CPU PHY (U1.B10), Page12 SOM Interface (J3.35)
USB1_TX_P: Page07 CPU PHY (U1.A10), Page12 SOM Interface (J3.37)
USB1_VBUS_3V3: Page07 CPU PHY (U1.A11), Page10 BOOT_CFG (TP57.1), Page12 SOM Interface (J3.44)
USB2_D_N: Page07 CPU PHY (U1.E14), Page12 SOM Interface (J3.54)
USB2_D_P: Page07 CPU PHY (U1.D14), Page12 SOM Interface (J3.56)
USB2_RX_N: Page07 CPU PHY (U1.B12), Page12 SOM Interface (J3.41)
USB2_RX_P: Page07 CPU PHY (U1.A12), Page12 SOM Interface (J3.43)
USB2_TX_N: Page07 CPU PHY (U1.B13), Page12 SOM Interface (J3.47)
USB2_TX_P: Page07 CPU PHY (U1.A13), Page12 SOM Interface (J3.49)
USB2_VBUS_3V3: Page07 CPU PHY (U1.D12), Page12 SOM Interface (J3.50)
WDOG_B: Page06 CPU IO (U1.B6), Page11 PMIC (R60.1 TP41.1), Page12 SOM Interface (J3.10)